# Altium project Pinus_V2.PrjPCB
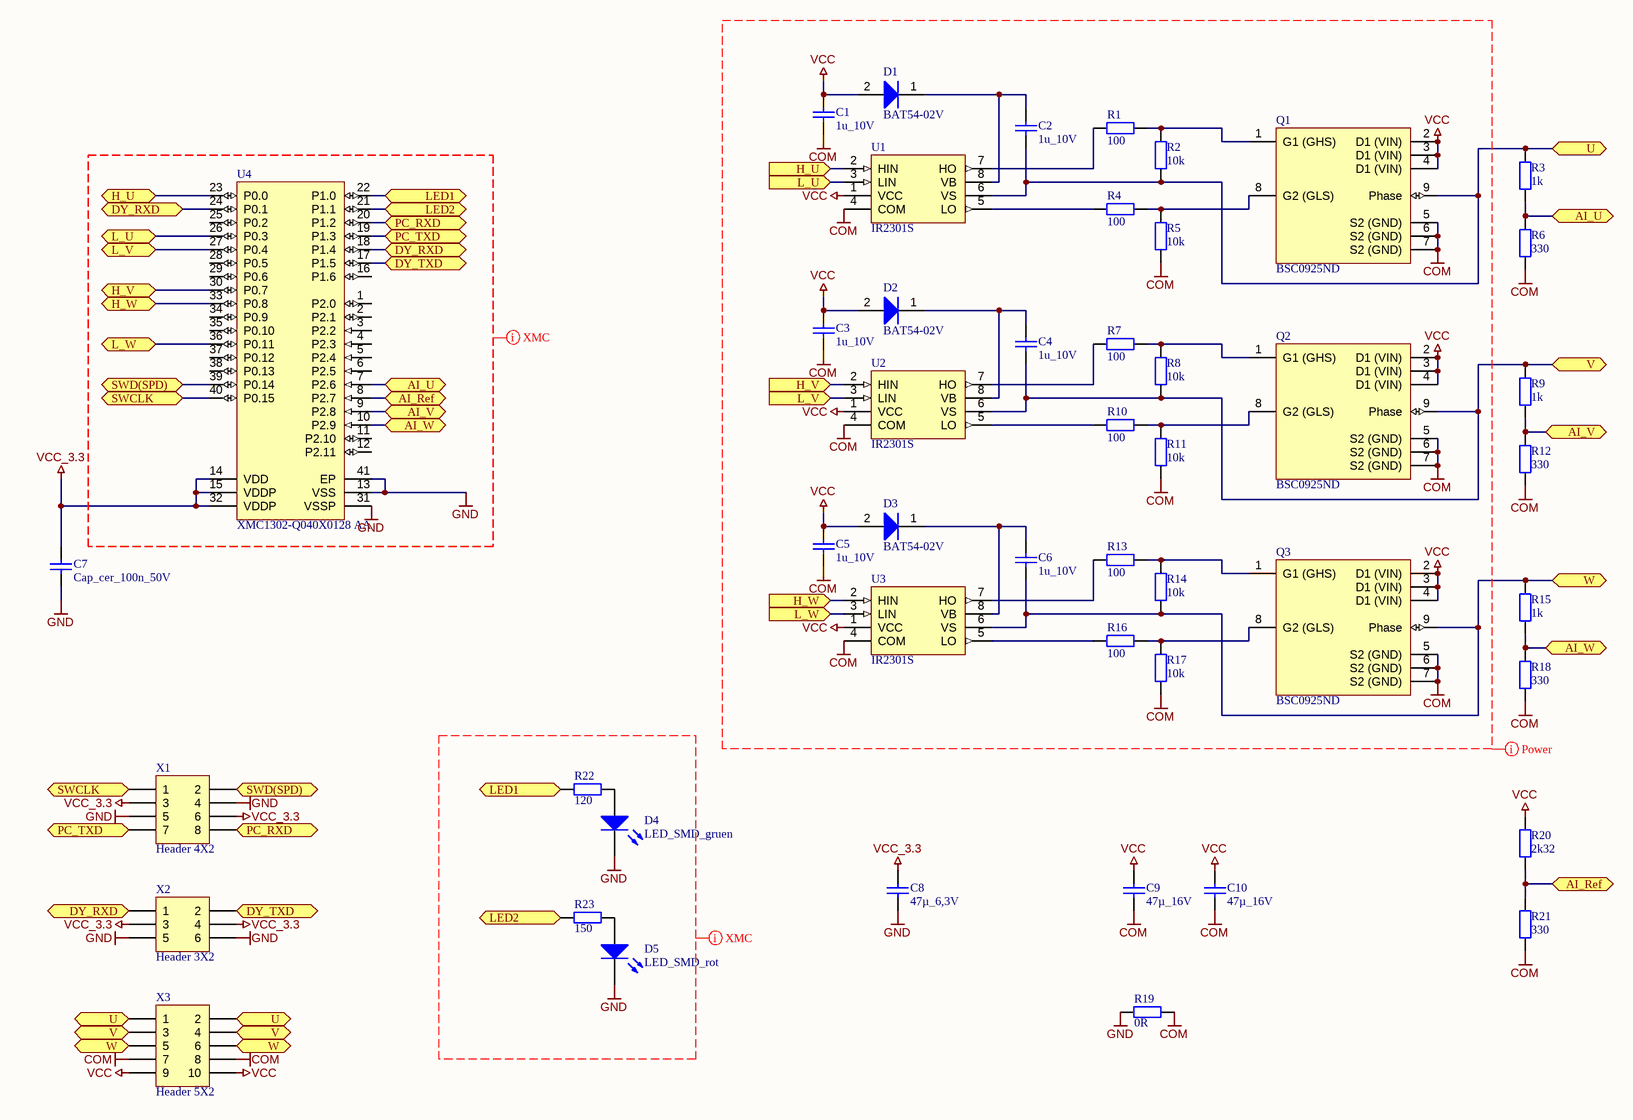
[diagram p0: Pinus_V2.SchDoc]
myStatus: Status: finished; myProjectName: Pinus BLDC Controller
1 sheet, 48 parts. Net scope: flat (ports and power ports of the same name join across sheets).
Board file: Pinus_V2.PcbDoc

## Sheet Pinus_V2.SchDoc: PINUS
size A3; DrawnBy: RoS; Organization: MCI; Revision: 1; SheetNumber: 1; SheetTotal: 1; ProjectName: Pinus

### Parts
C1  1u_10V  [1608[0603]]
C2  1u_10V  [1608[0603]]
C3  1u_10V  [1608[0603]]
C4  1u_10V  [1608[0603]]
C5  1u_10V  [1608[0603]]
C6  1u_10V  [1608[0603]]
C7  Cap_cer_100n_50V  [1608[0603]]
C8  47µ_6,3V  [_0805]
C9  47µ_16V  [_1206]
C10  47µ_16V  [_1206]
D1  BAT54-02V  [INF-SC79_V]
D2  BAT54-02V  [INF-SC79_V]
D3  BAT54-02V  [INF-SC79_V]
D4  LED_SMD_gruen  [LED_SMD]
D5  LED_SMD_rot  [LED_SMD]
Q1  BSC0925ND  [INF-PG-TISON-8_V]
Q2  BSC0925ND  [INF-PG-TISON-8_V]
Q3  BSC0925ND  [INF-PG-TISON-8_V]
R1  value 100  [1608[0603]]  (hidden comment: Res_0603)
R2  value 10k  [1608[0603]]  (hidden comment: Res_0603)
R3  value 1k  [1608[0603]]  (hidden comment: Res_0603)
R4  value 100  [1608[0603]]  (hidden comment: Res_0603)
R5  value 10k  [1608[0603]]  (hidden comment: Res_0603)
R6  value 330  [1608[0603]]  (hidden comment: Res_0603)
R7  value 100  [1608[0603]]  (hidden comment: Res_0603)
R8  value 10k  [1608[0603]]  (hidden comment: Res_0603)
R9  value 1k  [1608[0603]]  (hidden comment: Res_0603)
R10  value 100  [1608[0603]]  (hidden comment: Res_0603)
R11  value 10k  [1608[0603]]  (hidden comment: Res_0603)
R12  value 330  [1608[0603]]  (hidden comment: Res_0603)
R13  value 100  [1608[0603]]  (hidden comment: Res_0603)
R14  value 10k  [1608[0603]]  (hidden comment: Res_0603)
R15  value 1k  [1608[0603]]  (hidden comment: Res_0603)
R16  value 100  [1608[0603]]  (hidden comment: Res_0603)
R17  value 10k  [1608[0603]]  (hidden comment: Res_0603)
R18  value 330  [1608[0603]]  (hidden comment: Res_0603)
R19  value 0R  [1608[0603]]  (hidden comment: Res_0603)
R20  value 2k32  [1608[0603]]  (hidden comment: Res_0603)
R21  value 330  [1608[0603]]  (hidden comment: Res_0603)
R22  value 120  [1608[0603]]  (hidden comment: Res_0603)
R23  value 150  [1608[0603]]  (hidden comment: Res_0603)
U1  IR2301S  [SO-8_N]
U2  IR2301S  [SO-8_N]
U3  IR2301S  [SO-8_N]
U4  XMC1302-Q040X0128 AA  [INF-PG-VQFN-40-13_V]
X1  Header 4X2  [HDR2X4]
X2  Header 3X2  [HDR2X3]
X3  Header 5X2  [HDR2X5]

### Ports
AI_Ref (bidir), AI_U (bidir), AI_V (bidir), AI_W (bidir), DY_RXD, DY_TXD, H_U, H_V, H_W, L_U, L_V, L_W, LED1, LED2, PC_RXD, PC_TXD, SWCLK, SWD(SPD), U (bidir), V (bidir), W (bidir)

### Nets
COM: C1.2 C3.2 C5.2 C9.1 C10.1 Q1.5(S2_(GND)) Q1.6(S2_(GND)) Q1.7(S2_(GND)) Q2.5(S2_(GND)) Q2.6(S2_(GND)) Q2.7(S2_(GND)) Q3.5(S2_(GND)) Q3.6(S2_(GND)) Q3.7(S2_(GND)) R5.2 R6.2 R11.2 R12.2 R17.2 R18.2 R19.2 R21.2 U1.4(COM) U2.4(COM) U3.4(COM) X3.7 X3.8
GND: C7.1 C8.1 D4.2 D5.2 R19.1 U4.13(VSS) U4.31(VSSP) U4.41(EP) X1.4 X1.5 X2.5 X2.6
VCC: C1.1 C3.1 C5.1 C9.2 C10.2 D1.2(A) D2.2(A) D3.2(A) Q1.2(D1_(VIN)) Q1.3(D1_(VIN)) Q1.4(D1_(VIN)) Q2.2(D1_(VIN)) Q2.3(D1_(VIN)) Q2.4(D1_(VIN)) Q3.2(D1_(VIN)) Q3.3(D1_(VIN)) Q3.4(D1_(VIN)) R20.1 U1.1(VCC) U2.1(VCC) U3.1(VCC) X3.9 X3.10
VCC_3.3: C7.2 C8.2 U4.14(VDD) U4.15(VDDP) U4.32(VDDP) X1.3 X1.6 X2.3 X2.4
NetC2_1: C2.1 D1.1(K) U1.8(VB)
NetC2_2: C2.2 Q1.9(Phase) R2.2 R3.1 U1.6(VS) X3.1 X3.2 ; port U
NetC4_1: C4.1 D2.1(K) U2.8(VB)
NetC4_2: C4.2 Q2.9(Phase) R8.2 R9.1 U2.6(VS) X3.3 X3.4 ; port V
NetC6_1: C6.1 D3.1(K) U3.8(VB)
NetC6_2: C6.2 Q3.9(Phase) R14.2 R15.1 U3.6(VS) X3.5 X3.6 ; port W
NetD4_1: D4.1 R22.2
NetD5_1: D5.1 R23.2
NetQ1_1: Q1.1(G1_(GHS)) R1.1 R2.1
NetQ1_8: Q1.8(G2_(GLS)) R4.1 R5.1
NetQ2_1: Q2.1(G1_(GHS)) R7.1 R8.1
NetQ2_8: Q2.8(G2_(GLS)) R10.1 R11.1
NetQ3_1: Q3.1(G1_(GHS)) R13.1 R14.1
NetQ3_8: Q3.8(G2_(GLS)) R16.1 R17.1
NetR1_2: R1.2 U1.7(HO)
NetR3_2: R3.2 R6.1 U4.7(P2.6) ; port AI_U
NetR4_2: R4.2 U1.5(LO)
NetR7_2: R7.2 U2.7(HO)
NetR9_2: R9.2 R12.1 U4.9(P2.8) ; port AI_V
NetR10_2: R10.2 U2.5(LO)
NetR13_2: R13.2 U3.7(HO)
NetR15_2: R15.2 R18.1 U4.10(P2.9) ; port AI_W
NetR16_2: R16.2 U3.5(LO)
NetR20_2: R20.2 R21.1 U4.8(P2.7) ; port AI_Ref
NetR22_1: R22.1 U4.22(P1.0) ; port LED1
NetR23_1: R23.1 U4.21(P1.1) ; port LED2
NetU1_2: U1.2(HIN) U4.23(P0.0) ; port H_U
NetU1_3: U1.3(LIN) U4.26(P0.3) ; port L_U
NetU2_2: U2.2(HIN) U4.30(P0.7) ; port H_V
NetU2_3: U2.3(LIN) U4.27(P0.4) ; port L_V
NetU3_2: U3.2(HIN) U4.33(P0.8) ; port H_W
NetU3_3: U3.3(LIN) U4.36(P0.11) ; port L_W
NetU4_17: U4.17(P1.5) X2.2 ; port DY_TXD
NetU4_18: U4.18(P1.4) U4.24(P0.1) X2.1 ; port DY_RXD
NetU4_19: U4.19(P1.3) X1.7 ; port PC_TXD
NetU4_20: U4.20(P1.2) X1.8 ; port PC_RXD
NetU4_39: U4.39(P0.14) X1.2 ; port SWD(SPD)
NetU4_40: U4.40(P0.15) X1.1 ; port SWCLK

Not connected (* = marked no-connect by the designer): U4 1(P2.0) 2(P2.1) 3(P2.2) 4(P2.3) 5(P2.4) 6(P2.5) 11(P2.10) 12(P2.11) 16(P1.6) 25(P0.2) 28(P0.5) 29(P0.6) 34(P0.9) 35(P0.10) 37(P0.12) 38(P0.13)

### Layout directives
net class XMC: GND
net class Power: COM, VCC

### Notes on the sheet
- Project
- Date:
- Drawn by:
- Time:
- Number:
- Revision:
- Sheet
- of
- ELECTRONICS
- File:

### Library data of the parts
C1-C6 = Cap_133: RS_number: 788-2884; QR: 0; Capacity: 1u; Voltage: 10V; UID: Cap_133; Name: 1u_10V; Name_Hyperlink: http://at.rs-online.com/web/p/keramik-multilayer-kondensatoren/7882884; ComponentLink1URL: #NAME?; mounting: SMD
C7 = Cap_124: QR: 0; Capacity: 100n; Voltage: 50V; RS Bestellnummer: 788-2985; UID: Cap_124; Name: Cap_cer_100n_50V; ComponentLink1URL: #NAME?; mounting: SMD0603
C8 = Cap_63: Capacity: 47µ; Voltage: 6,3V; UID: Cap_63; Name: 47µ_6,3V; ComponentLink1URL: #NAME?; mounting: SMD
C9 C10 = Cap_64: Capacity: 47µ; Voltage: 16V; UID: Cap_64; Name: 47µ_16V; ComponentLink1URL: #NAME?; mounting: SMD
D1-D3 = BAT54-02V: Silicon Schottky Diode, SC79, Reel, Green; Manufacturer: Infineon; Green: TRUE; PackageReference: SC79; PackageDescription: 2-Pin Semiconductor Package, 0.8 x 1.2 mm Body; Supplier 1: Mouser; Supplier Part Number 1: N/A; Halogen-free: FALSE; Mounting Technology: Surface Mount; PartNumber: BAT54-02V; ComponentLink1Description: Manufacturer URL; ComponentLink1URL: http://www.infineon.com/; ComponentLink2Description: Datasheet; ComponentLink2URL: http://www.infineon.com/dgdl/bat54series.pdf?folderId=db3a30431400ef68011425f1ca2505e3&fileId=db3a304314dca3890115190b74210ea6; ComponentLink3Description: Package Specification; ComponentLink3URL: http://www.infineon.com/dgdl/SC79-Package_Overview.pdf?folderId=db3a30431936bc4b011951fbddb03b15&fileId=db3a30431936bc4b01195226fe583b41
D4 = DIODE_50: Colour: gruen; RS_number: 664-8181; QR: 0; UID: DIODE_50; Name: LED_SMD_gruen; Name_Hyperlink: SMD_LED Hyper Mini TOPLED grün; ComponentLink1URL: #NAME?; mounting: SMD
D5 = DIODE_54: Colour: rot; RS_number: 688-9531; QR: 0; UID: DIODE_54; Name: LED_SMD_rot; Name_Hyperlink: SMD_MiniTOPLED schwarz superrot; ComponentLink1URL: #NAME?; mounting: SMD
Q1-Q3 = BSC0925ND: N-Channel OptiMOS Power-MOSFET, 30 V VDS, 40 A ID, -55 to 150 degC, PG-TISON-8, Reel, Green; Manufacturer: Infineon; Green: TRUE; ID (max): 40 A; IDpuls (max): 160 A; Polarity: N; Ptot (max): 30 W; QG: 6.7 nC; RDS (on) (max): 5 mOhm; RDS (on) (max) (@4.5V): 7 mOhm; Rth: 4.2 K/W; RthJA (max): 125 K/W; VDS (max): 30 V; VGS(th) (max): 2 V; VGS(th) (min): 1.2 V; DatasheetVersion: Rev. 1.0; PackageVersion: Rev. 01, 09/2011; PackageReference: PG-TISON-8; PackageDescription: 8-Pin Plastic (Green) Small Outline Non-Leaded Package, 5 x 6 mm Body, 1.27 mm Pitch; Halogen-free: TRUE; Packing: Reel; RthJC (max): 4.2 K/W; Mounting Technology: Surface Mount; PartNumber: BSC0925ND; ComponentLink1Description: Manufacturer URL; ComponentLink1URL: http://www.infineon.com/; ComponentLink2Description: Datasheet; ComponentLink2URL: http://www.infineon.com/dgdl/BSC0925ND_rev1+0.pdf?folderId=db3a304313b8b5a60113cee8763b02d7&fileId=db3a304336ca04c90136cec562a24914; ComponentLink3Description: Package Specification; ComponentLink3URL: http://www.infineon.com/dgdl/BSC0910NDI_Rev. 0.5.pdf?folderId=db3a304313b8b5a60113cee8763b02d7&fileId=db3a304336ca04c90136cedc08b64926
R1-R23 = Res_6: UID: Res_6; Name: Res_0603; ComponentLink1URL: #NAME?; mounting: SMD
U1-U3 = IR2101S: High and Low Side Driver; Published: 8-Jun-2000; LatestRevisionDate: 13-Apr-2006; LatestRevisionNote: IPC-7351 Footprint Added.; DatasheetVersion: PD60043J; PackageVersion: Feb-2001; PackageReference: SO-8; Publisher: Altium Limited; PackageDescription: 8-Pin Plastic Small Outline Integrated Circuit 1.27 mm Pitch; Code_JEDEC: MS-012-AA; Code_IPC: SOIC127P600-8; ComponentLink1Description: Manufacturer Link; ComponentLink1URL: http://www.irf.com/
U4 = XMC1302-Q040X0128 AA: 32 MHz XMC1300 MCU with 128 KByte Program Memory, 16 KByte SRAM, 3.3 V, 5 V, -40 to 105 degC, PG-VQFN-40, Reel, Green; Manufacturer: Infineon; A / D input lines (incl. FADC): 12; Digital I/O Lines: 34; E2PROM Emulation (Data-Flash): TRUE; Instruction set architecture: ARM(R) Cortex(TM)-M0 (32-bit); Instruction width [bits]: 32/16; Max Clock Frequency: 32 MHz; Power Modes: clock gating possible; Serial I/O Interfaces: 2; Type of Memory: Flash; Type of Serial I/O Interfaces: UART, SPI, I2C, I2S; DatasheetVersion: Rev. 1.4; PackageVersion: Rev. 01; PackageReference: PG-VQFN-40-13; PackageDescription: 40-Pin Plastic (Green) Very Thin Profile Quad Flat Non Leaded Package, 5 x 5 mm Body, 0.4 mm Pitch; Green: TRUE; Group: XMC1300; Halogen-free: TRUE; I/O Operation Voltages: 3.3 V, 5 V; On-chip clock generation: TRUE; On-chip Voltage Regulator: TRUE; Oscillator Watchdog: TRUE; Packing: Reel; Program Memory: 128 KByte; Real Time Clock (RTC): TRUE; SRAM (incl. Cache): 16 KByte; Watchdog Timer: TRUE; Mounting Technology: Surface Mount; PartNumber: XMC1302-Q040X0128 AA; ComponentLink1Description: Manufacturer URL; ComponentLink1URL: http://www.infineon.com/; ComponentLink2Description: Datasheet; ComponentLink2URL: http://www.infineon.com/dgdl/xmc1300_ds_v1.3_2014_02.pdf?folderId=db3a30433580b3710135a47f3eb76c98&fileId=db3a30433d1d0bbe013d256ee0aa0ccb; ComponentLink3Description: Package Specification; ComponentLink3URL: http://www.infineon.com/cms/packages/SMD_-_Surface_Mounted_Devices/P-PG-VQFN/P-PG-VQFN-040-13.html?__locale=en
X1 = Header 4X2: Header, 4-Pin, Dual row; LatestRevisionDate: 17-Jul-2002; LatestRevisionNote: Re-released for DXP Platform.; Publisher: Altium Limited
X2 = Header 3X2: Header, 3-Pin, Dual row; LatestRevisionDate: 17-Jul-2002; LatestRevisionNote: Re-released for DXP Platform.; Publisher: Altium Limited
X3 = Header 5X2: Header, 5-Pin, Dual row; LatestRevisionDate: 17-Jul-2002; LatestRevisionNote: Re-released for DXP Platform.; Publisher: Altium Limited